# Altium schematic sheet [01] Micro.SchDoc
size B; Organization: Altium Limited; Address1: L3, 12a Rodborough Rd; Address2: Frenchs Forest; Address3: NSW; Address4: Australia 2086
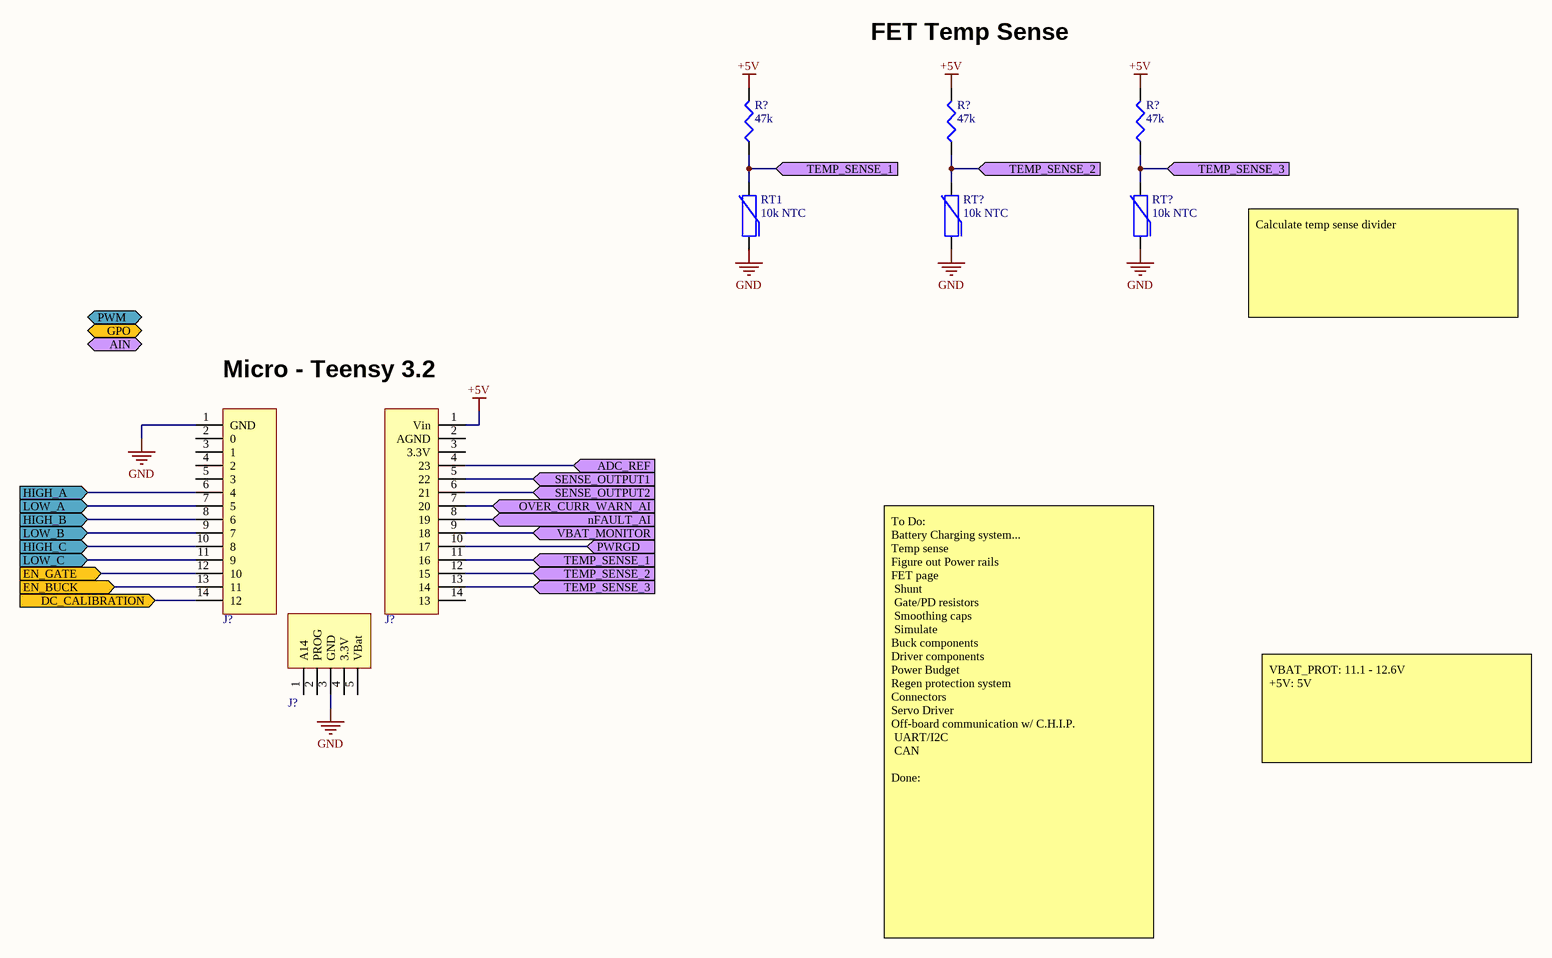
[diagram p0: [01] Micro.SchDoc]

## Parts
(Parts that share a designator on the sheet are numbered #1, #2 ... from top to bottom, then left to right.)
J?#1  HEADER TEENSY A  [14 POS HEADER]  (value not drawn)
J?#2  HEADER TEENSY C  [14 POS HEADER]  (value not drawn)
J?#3  HEADER TEENSY B  [5 POS HEADER]  (value not drawn)
R?#1  47k  [0603_CAP]
R?#2  47k  [0603_CAP]
R?#3  47k  [0603_CAP]
RT1  10k NTC  [0603_CAP]
RT?#1  10k NTC  [0603_CAP]
RT?#2  10k NTC  [0603_CAP]

## Ports
ADC_REF (in), AIN (bidir), DC_CALIBRATION (in), EN_BUCK (in), EN_GATE (in), GPO (bidir), HIGH_A (in), HIGH_B (in), HIGH_C (in), LOW_A (in), LOW_B (in), LOW_C (in), nFAULT_AI (in), OVER_CURR_WARN_AI (in), PWM (bidir), PWRGD (in), SENSE_OUTPUT1 (in), SENSE_OUTPUT2 (in), TEMP_SENSE_1 (in), TEMP_SENSE_2 (in), TEMP_SENSE_3 (in), VBAT_MONITOR (in)

## Nets
+5V: J?#2.1(Vin) R?#1.2 R?#2.2 R?#3.2
GND: J?#1.1(GND) J?#3.3(GND) RT1.1 RT?#1.1 RT?#2.1
ADC_REF: J?#2.4(23) ; port ADC_REF
DC_CALIBRATION: J?#1.14(12) ; port DC_CALIBRATION
EN_BUCK: J?#1.13(11) ; port EN_BUCK
EN_GATE: J?#1.12(10) ; port EN_GATE
HIGH_A: J?#1.6(4) ; port HIGH_A
HIGH_B: J?#1.8(6) ; port HIGH_B
HIGH_C: J?#1.10(8) ; port HIGH_C
LOW_A: J?#1.7(5) ; port LOW_A
LOW_B: J?#1.9(7) ; port LOW_B
LOW_C: J?#1.11(9) ; port LOW_C
nFAULT_AI: J?#2.8(19) ; port nFAULT_AI
OVER_CURR_WARN_AI: J?#2.7(20) ; port OVER_CURR_WARN_AI
PWRGD: J?#2.10(17) ; port PWRGD
SENSE_OUTPUT1: J?#2.5(22) ; port SENSE_OUTPUT1
SENSE_OUTPUT2: J?#2.6(21) ; port SENSE_OUTPUT2
TEMP_SENSE_1: J?#2.11(16) R?#1.1 RT1.2 ; port TEMP_SENSE_1
TEMP_SENSE_2: J?#2.12(15) R?#2.1 RT?#1.2 ; port TEMP_SENSE_2
TEMP_SENSE_3: J?#2.13(14) R?#3.1 RT?#2.2 ; port TEMP_SENSE_3
VBAT_MONITOR: J?#2.9(18) ; port VBAT_MONITOR

Not connected (* = marked no-connect by the designer): J?#1 2(0) 3(1) 4(2) 5(3); J?#2 2(AGND) 3(3.3V) 14(13); J?#3 1(A14) 2(PROG) 4(3.3V) 5(VBat)

## Notes on the sheet
- FET Temp Sense
- Calculate temp sense divider
- (near J?#1) Micro - Teensy 3.2
- VBAT_PROT: 11.1 - 12.6V
  +5V: 5V
- To Do:
  Battery Charging system...
  Temp sense
  Figure out Power rails
  FET page
  Shunt
  Gate/PD resistors
  Smoothing caps
  Simulate
  Buck components
  Driver components
  Power Budget
  Regen protection system
  Connectors
  Servo Driver
  Off-board communication w/ C.H.I.P.
  UART/I2C
  CAN
  Done:
- Title
- Size:
- Date:
- B
- Number:
- Time:
- Revision:
- Sheet
- of
- File:

## Library data of the parts
J?#1 = HEADER TEENSY A: SOCKET 7 MM SOLDER TAIL SINGLE; Manufacturer 1: Preci-Dip; Manufacturer Part Number 1: 801-87-014-10-001101; Category 1: Connectors, Interconnects; Number of Positions: 14; Number of Positions Loaded: All; Pitch: 0.100" (2.54mm); Supplier 1: Digi-Key; RoHS: RoHS Compliant; Description 1: SOCKET 7 MM SOLDER TAIL SINGLE; Stock 1: 1111; Pricing 1: 1=1.21, 10=1.065, 100=0.9185, 500=0.75148, 1000=0.66798, 5000=0.58449, 10000=0.55526 (USD); Packaging: Bulk; Part Status: Active; Connector Type: Socket; Contact Type: Female Socket; Number of Rows: 1; Row Spacing: -; Mounting Type: Through Hole; Termination: Solder; Fastening Type: -; Features: -; Contact Finish: Gold; Contact Finish Thickness: Flash; Color: Black; ComponentLink1URL: http://www.precidip.com/AppHost/9696,1/Scripts/Modules/Catalog/Default.aspx?c=7&i=310&p=107&pdf=1&dsku=801-PP-NNN-10-001101; ComponentLink1Description: http://www.precidip.com/AppHost/9696,1/Scripts/Modules/Catalog/Default.aspx?c=7&i=310&p=107&pdf=1&dsku=801-PP-NNN-10-001101; Supplier Part Number 1: 1212-1201-ND
J?#2 = HEADER TEENSY C: SOCKET 7 MM SOLDER TAIL SINGLE; Manufacturer 1: Preci-Dip; Manufacturer Part Number 1: 801-87-014-10-001101; Category 1: Connectors, Interconnects; Number of Positions: 14; Number of Positions Loaded: All; Pitch: 0.100" (2.54mm); Supplier 1: Digi-Key; RoHS: RoHS Compliant; Description 1: SOCKET 7 MM SOLDER TAIL SINGLE; Stock 1: 1111; Pricing 1: 1=1.21, 10=1.065, 100=0.9185, 500=0.75148, 1000=0.66798, 5000=0.58449, 10000=0.55526 (USD); Packaging: Bulk; Part Status: Active; Connector Type: Socket; Contact Type: Female Socket; Number of Rows: 1; Row Spacing: -; Mounting Type: Through Hole; Termination: Solder; Fastening Type: -; Features: -; Contact Finish: Gold; Contact Finish Thickness: Flash; Color: Black; ComponentLink1URL: http://www.precidip.com/AppHost/9696,1/Scripts/Modules/Catalog/Default.aspx?c=7&i=310&p=107&pdf=1&dsku=801-PP-NNN-10-001101; ComponentLink1Description: http://www.precidip.com/AppHost/9696,1/Scripts/Modules/Catalog/Default.aspx?c=7&i=310&p=107&pdf=1&dsku=801-PP-NNN-10-001101; Supplier Part Number 1: 1212-1201-ND
J?#3 = HEADER TEENSY B: SOCKET 7 MM SOLDER TAIL SINGLE; Manufacturer 1: Preci-Dip; Manufacturer Part Number 1: 801-87-005-10-001101; Category 1: Connectors, Interconnects; Number of Positions: 5; Number of Positions Loaded: All; Pitch: 0.100" (2.54mm); Supplier 1: Digi-Key; RoHS: RoHS Compliant; Description 1: SOCKET 7 MM SOLDER TAIL SINGLE; Stock 1: 1229; Pricing 1: 1=0.49, 10=0.459, 100=0.3521, 500=0.3062, 1000=0.25262, 5000=0.222, 10000=0.20669 (USD); Packaging: Bulk; Part Status: Active; Connector Type: Socket; Contact Type: Female Socket; Number of Rows: 1; Row Spacing: -; Mounting Type: Through Hole; Termination: Solder; Fastening Type: -; Features: -; Contact Finish: Gold; Contact Finish Thickness: Flash; Color: Black; ComponentLink1URL: http://www.precidip.com/AppHost/9696,1/Scripts/Modules/Catalog/Default.aspx?c=7&i=310&p=107&pdf=1&dsku=801-PP-NNN-10-001101; ComponentLink1Description: http://www.precidip.com/AppHost/9696,1/Scripts/Modules/Catalog/Default.aspx?c=7&i=310&p=107&pdf=1&dsku=801-PP-NNN-10-001101; Supplier Part Number 1: 1212-1183-ND
R?#1-R?#3 = RC0603FR-073K3L: RES SMD 3.3K OHM 1% 1/10W 0603; Manufacturer 1: Yageo; Category 1: Resistors; Power (Watts): 0.1W, 1/10W; Temperature Coefficient: ±100ppm/°C; Supplier 1: Digi-Key; Manufacturer Part Number 1: RC0603FR-073K3L; RoHS: RoHS Compliant; Description 1: RES SMD 3.3K OHM 1% 1/10W 0603; Stock 1: 668905; Pricing 1: 1=0.1, 10=0.014, 25=0.01, 100=0.0057, 250=0.00436, 500=0.00348, 1000=0.00257, 2500=0.00223 (USD); Packaging: Cut Tape (CT); Resistance (Ohms): 3.3k; Tolerance: ±1%; Composition: Thick Film; Features: Moisture Resistant; Operating Temperature: -55°C ~ 155°C; Package / Case: 0603 (1608 Metric); Supplier Device Package: 0603; Size / Dimension: 0.063" L x 0.031" W (1.60mm x 0.80mm); Height: 0.022" (0.55mm); Number of Terminations: 2; ComponentLink1URL: http://www.yageo.com/documents/recent/PYu-RC_Group_51_RoHS_L_04.pdf; ComponentLink1Description: http://www.yageo.com/documents/recent/PYu-RC_Group_51_RoHS_L_04.pdf; Supplier Part Number 1: 311-3.30KHRCT-ND
RT1 RT?#1 RT?#2 = NCP18XH103J03RB: THERMISTOR 10K OHM NTC 0603 SMD; Manufacturer 1: Murata Electronics North America; Category 1: Sensors, Transducers; Resistance Tolerance: ±5%; B Value Tolerance: ±1%; B25/50: 3380K; B25/85: 3434K; B25/100: 3455K; Power - Max: 100mW; Supplier 1: Digi-Key; Manufacturer Part Number 1: NCP18XH103J03RB; RoHS: RoHS Compliant; Description 1: THERMISTOR 10K OHM NTC 0603 SMD; Stock 1: 94115; Pricing 1: 1=0.2, 10=0.169, 25=0.1556, 50=0.1244, 100=0.1067, 250=0.09776, 500=0.09332, 1000=0.07999 (USD); Packaging: Cut Tape (CT); Resistance in Ohms @ 25°C: 10k; B0/50: -; B25/75: -; Operating Temperature: -40°C ~ 125°C; Length - Lead Wire: -; Mounting Type: Surface Mount; Package / Case: 0603 (1608 Metric); ComponentLink1URL: http://www.murata.com/~/media/webrenewal/support/library/catalog/products/thermistor/ntc/r44e.ashx; ComponentLink1Description: http://www.murata.com/~/media/webrenewal/support/library/catalog/products/thermistor/ntc/r44e.ashx; Supplier Part Number 1: 490-2436-1-ND